# EAGLE design boxcar-v2c (EAGLE 5.10)
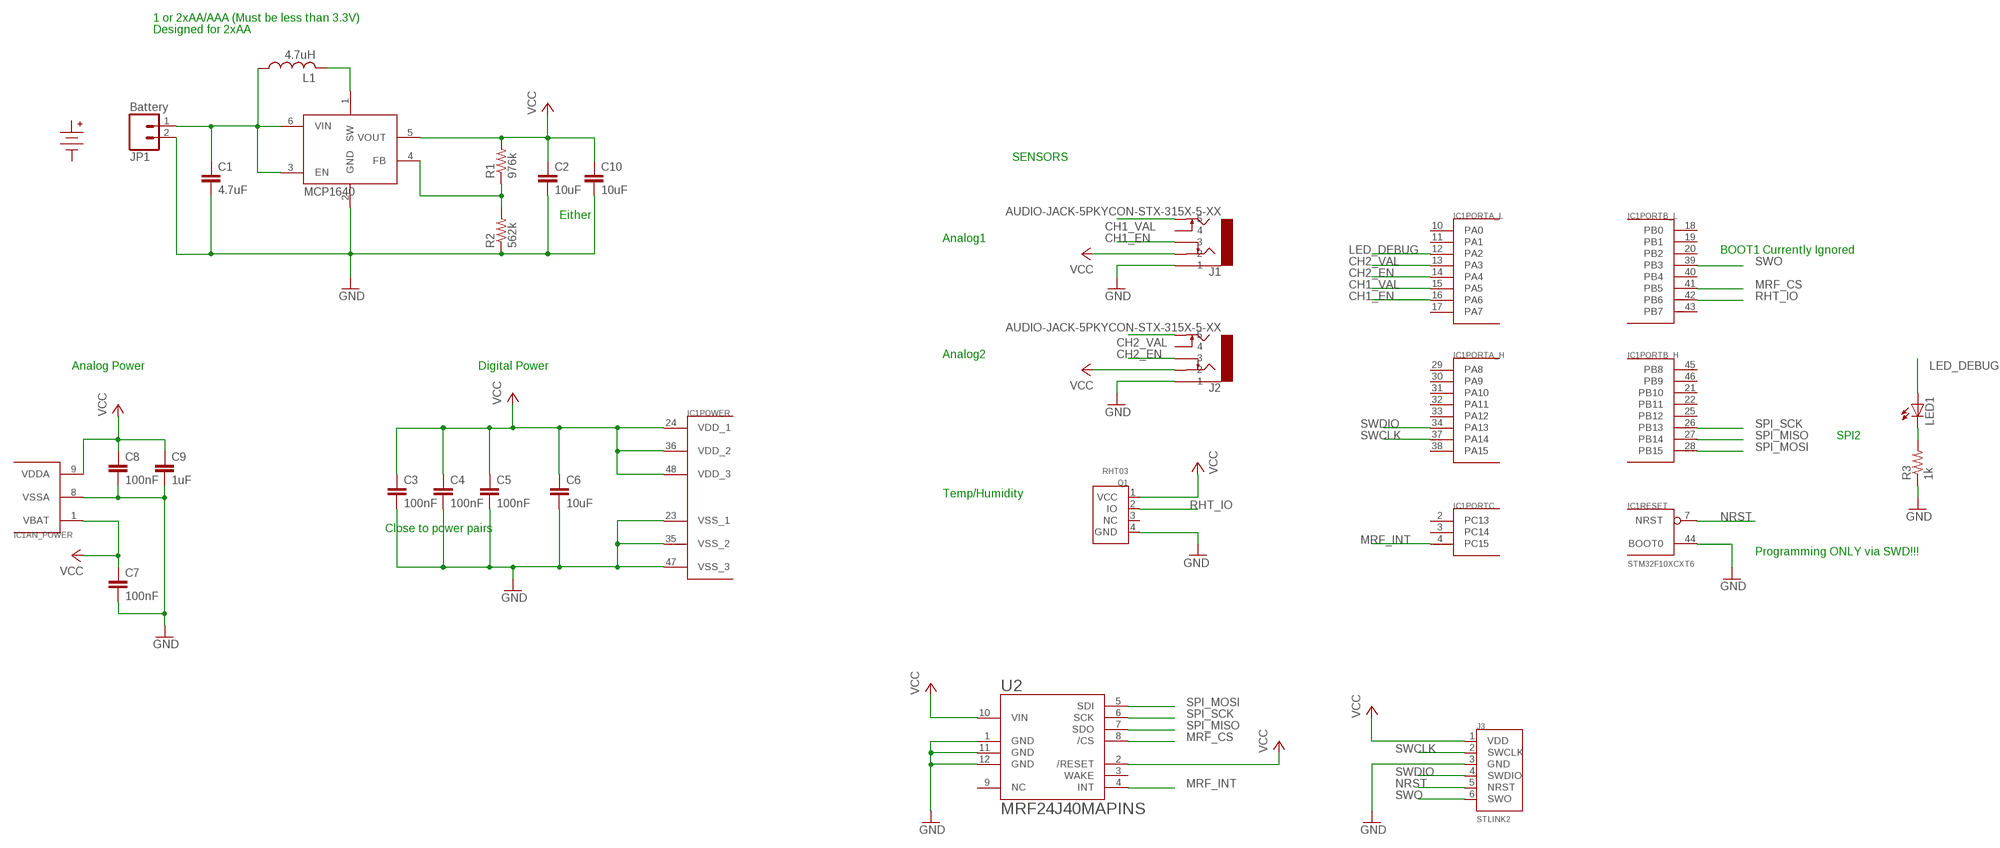
[diagram p0: schematic, sheet 1]

## Parts
C1  4.7uF  CAP0805  [0805]
C2  10uF  CAP0805  [0805]
C3  100nF  CAP0805  [0805]
C4  100nF  CAPPTH  [CAP-PTH-SMALL]
C5  100nF  CAP0805  [0805]
C6  10uF  CAP0805  [0805]
C7  100nF  CAP0805  [0805]
C8  100nF  CAP0805  [0805]
C9  1uF  CAPPTH  [CAP-PTH-SMALL]
C10  10uF  CAPPTH1  [CAP-PTH-5MM]
IC1  STM32F10XCXT6  [TQFP48]
J1  AUDIO-JACK-5PKYCON-STX-315X-5-XX  [KYCON-STX-315X-5-XX]
J2  AUDIO-JACK-5PKYCON-STX-315X-5-XX  [KYCON-STX-315X-5-XX]
J3  STLINK2  [STLINK2]
JP1  Battery  M02PTH  [1X02]
L1  4.7uH  LLQH44P_P0  [LQH44]
LED1  LED3MM  [LED3MM]
Q1  RHT03  [RHT03]
R1  976k  RESISTOR0805-RES  [0805]
R2  562k  RESISTOR0805-RES  [0805]
R3  1k  RESISTOR0805-RES  [0805]
U1  MCP1640  [SOT23-6]
U2  MRF24J40MAPINS  [MRF24J40MA]
U$1  BATTERY_LEADS  [KEYSTONE-2463]

## Nets
BAT+: C1.1 JP1.1 L1.P$1 U1.3(EN) U1.6(VIN)
CH1_EN: IC1.16(PORTA_L:PA6) J1.P$5
CH1_VAL: IC1.15(PORTA_L:PA5) J1.P$4
CH2_EN: IC1.14(PORTA_L:PA4) J2.P$5
CH2_VAL: IC1.13(PORTA_L:PA3) J2.P$4
GND: C1.2 C2.2 C3.2 C4.2 C5.2 C6.2 C7.2 C8.2 C9.2 C10.2 IC1.8(AN_POWER:VSSA) IC1.23(POWER:VSS_1) IC1.35(POWER:VSS_2) IC1.44(RESET:BOOT0) IC1.47(POWER:VSS_3) J1.P$1 J2.P$1 J3.3(GND) JP1.2 Q1.4(GND) R2.1 R3.1 U1.2(GND) U2.1(GND) U2.11(GND) U2.12(GND)
LED_DEBUG: IC1.12(PORTA_L:PA2) LED1.A
MRF_CS: IC1.41(PORTB_L:PB5) U2.8(/CS)
MRF_INT: IC1.4(PORTC:PC15) U2.4(INT)
N$1: L1.P$2 U1.1(SW)
N$3: LED1.K(C) R3.2
N$4: R1.1 R2.2 U1.4(FB)
NRST: IC1.7(RESET:NRST) J3.5(NRST)
RHT_IO: IC1.42(PORTB_L:PB6) Q1.2(IO)
SPI_MISO: IC1.27(PORTB_H:PB14) U2.7(SDO)
SPI_MOSI: IC1.28(PORTB_H:PB15) U2.5(SDI)
SPI_SCK: IC1.26(PORTB_H:PB13) U2.6(SCK)
SWCLK: IC1.37(PORTA_H:PA14) J3.2(SWCLK)
SWDIO: IC1.34(PORTA_H:PA13) J3.4(SWDIO)
SWO: IC1.39(PORTB_L:PB3) J3.6(SWO)
VCC: C2.1 C3.1 C4.1 C5.1 C6.1 C7.1 C8.1 C9.1 C10.1 IC1.1(AN_POWER:VBAT) IC1.9(AN_POWER:VDDA) IC1.24(POWER:VDD_1) IC1.36(POWER:VDD_2) IC1.48(POWER:VDD_3) J1.P$2 J2.P$2 J3.1(VDD) Q1.1(VCC) R1.2 U1.5(VOUT) U2.2(/RESET) U2.10(VIN)
Unconnected: IC1.2(PORTC:PC13) IC1.3(PORTC:PC14) IC1.5(PORTD/OSC:PD0/OSC<=) IC1.6(PORTD/OSC:PD1/OSC=>) IC1.10(PORTA_L:PA0) IC1.11(PORTA_L:PA1) IC1.17(PORTA_L:PA7) IC1.18(PORTB_L:PB0) IC1.19(PORTB_L:PB1) IC1.20(PORTB_L:PB2) IC1.21(PORTB_H:PB10) IC1.22(PORTB_H:PB11) IC1.25(PORTB_H:PB12) IC1.29(PORTA_H:PA8) IC1.30(PORTA_H:PA9) IC1.31(PORTA_H:PA10) IC1.32(PORTA_H:PA11) IC1.33(PORTA_H:PA12) IC1.38(PORTA_H:PA15) IC1.40(PORTB_L:PB4) IC1.43(PORTB_L:PB7) IC1.45(PORTB_H:PB8) IC1.46(PORTB_H:PB9) J1.P$3 J2.P$3 Q1.3(NC) U2.3(WAKE) U2.9(NC)

## Notes on the sheet
- 1 or 2xAA/AAA (Must be less than 3.3V)
- Designed for 2xAA
- SENSORS
- Either
- Analog1
- BOOT1 Currently Ignored
- Analog2
- Analog Power | Digital Power
- SPI2
- Temp/Humidity
- Close to power pairs
- Programming ONLY via SWD!!!

## Library data of the parts
C1-C10 = SparkFun:CAP: Capacitor Standard 0603 ceramic capacitor, and 0.1" leaded capacitor.
IC1 = stm32:STM32F10XCXT6: ST STM32F101/103 48pin LQFP
J1 J2 = karlnet-parts:AUDIO-JACK-5P: Stereo Audio Jack, with switches for each signal contact
J3 = karlnet-parts:STLINK2: STLink/v2 connector 6 pin inline header for SWD, as used on STM32 Discovery boards. (Except the 32VL discovery board, which only has the top 4 pins)
JP1 = SparkFun:M02: Header 2 Standard 2-pin 0.1" header. Use with straight break away headers (SKU : PRT-00116), right angle break away headers (PRT-00553), swiss pins (PRT-00743), machine pins (PRT-00117), and female headers (PRT-00115). Molex polarized connector foot print use with SKU : PRT-08233 with associated crimp pins and housings.
L1 = karlnet-parts:L
LED1 = SparkFun:LED: LEDs Standard schematic elements and footprints for 5mm, 3mm, 1206, and 0603 sized LEDs. 5mm - Spark Fun Electronics SKU : COM-00529 (and others)
Q1 = karlnet-parts:RHT03: RHT03 Temperature/Humidity sensor Also known as DHT22 and AM2302 Utilises a proprietary single pin interface. Occasionally reported to have pin 3 and 4 swapped (NC and ground) See also Sparkfun product page <http://www.sparkfun.com/products/10167>
R1-R3 = SparkFun:RESISTOR: Resistor Basic schematic elements and footprints for 0603, 1206, and PTH resistors.
U1 = karlnet-parts:MCP1640: MCP1623, 1624, 1640/B/C/D pwm/pfm or pwm only DC/DC converters, in SOT-23
U2 = karlnet-parts:MRF24J40MA: MRF24J40MA module, 802.15.4 from microchip.
U$1 = karlnet-parts:BATTERY_LEADS: Battery holders with leads, ie, mechanical placement only, no electrical connections

## Board
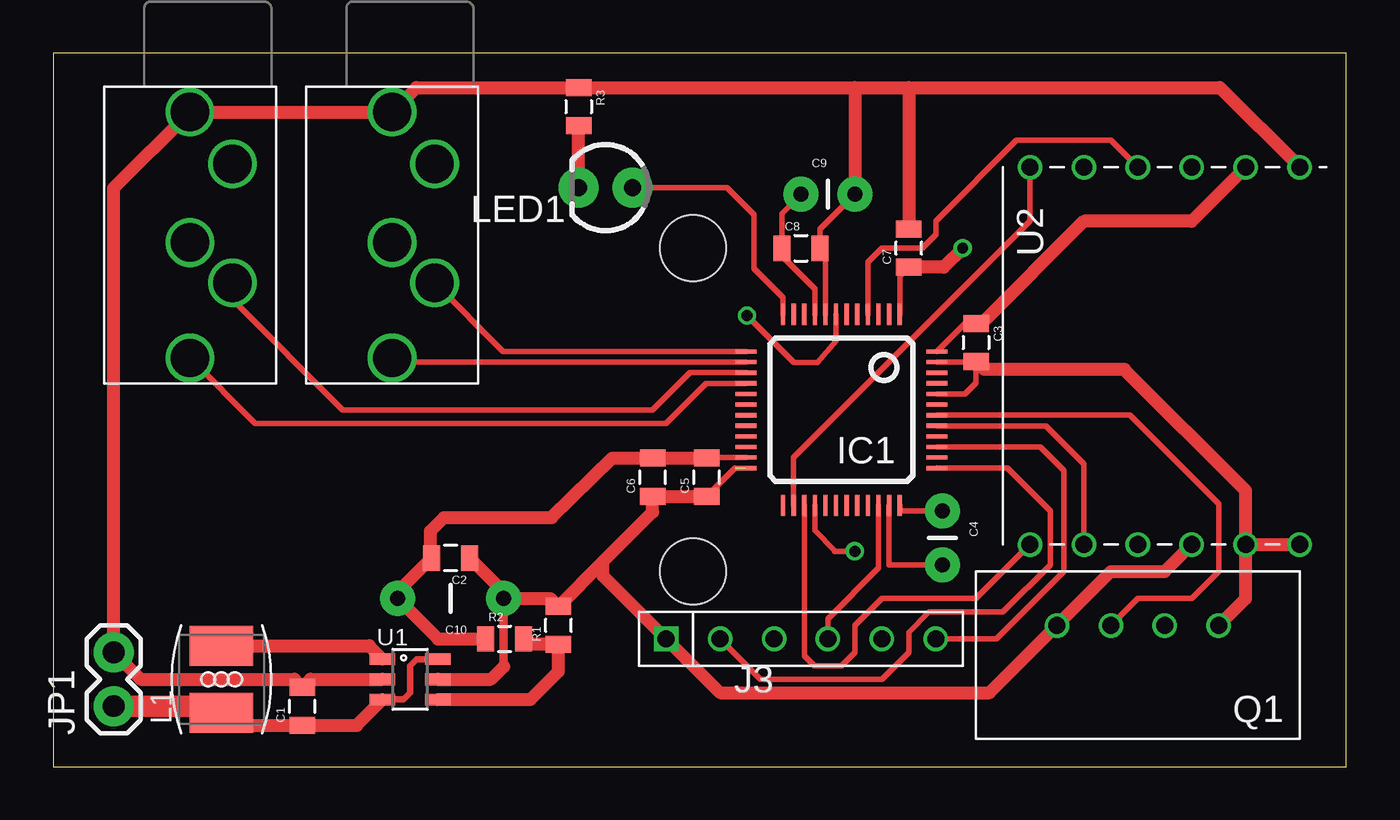
[diagram p1: board, top side]
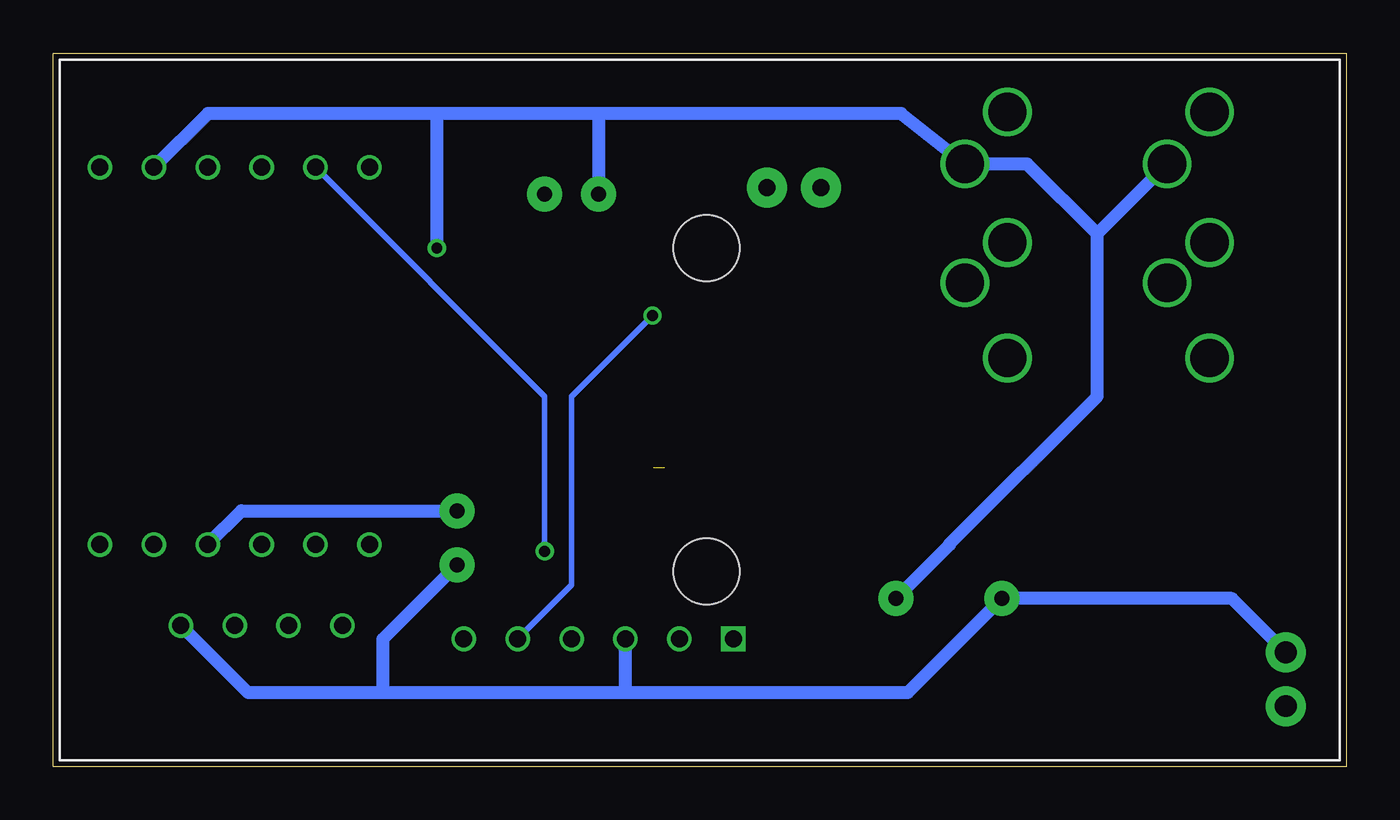
[diagram p2: board, bottom side, seen from below]

Size 60.95 x 33.65 mm. Coordinates in mm from the lower left corner, seen from the top.
Outline: 0,0 60.95,0 60.95,33.65 0,33.65 0,0
Copper layers (1*16): Top 0.0356mm / dielectric 1.5011mm / Bottom 0.0356mm
Design rules "dorkbot__LaenPCBOrder *": minimum track width 6mil, minimum drill 13mil, track to track 6mil, track to pad 6mil, pad to pad 6mil, via to via 6mil, smd to smd 6mil, copper to edge 15mil, drill to drill 6mil, minimum pad ring 7mil, minimum via ring 7mil, stop-mask expansion 4mil, vias tented up to drill 0mil, thermal gap 10mil

### Footprints (pad centres in the part's own frame; a part is rotated, then mirrored left to right if it is on the bottom)
0805 = smd 0.8 x 1.2: 1 -0.9,0; 2 0.9,0
CAP-PTH-SMALL = drill 0.7 pad 1.651 round: 1 0,0; 2 2.54,0
CAP-PTH-5MM = drill 0.7 pad 1.651 round: 1 -2.5,0; 2 2.5,0
TQFP48 = smd 0.2 x 1: 1 -2.75,-4.5; 2 -2.25,-4.5; 3 -1.75,-4.5; 4 -1.25,-4.5; 5 -0.75,-4.5; 6 -0.25,-4.5; 7 0.25,-4.5; 8 0.75,-4.5; 9 1.25,-4.5; 10 1.75,-4.5; 11 2.25,-4.5; 12 2.75,-4.5; 25 2.75,4.5; 26 2.25,4.5; 27 1.75,4.5; 28 1.25,4.5; 29 0.75,4.5; 30 0.25,4.5; 31 -0.25,4.5; 32 -0.75,4.5; 33 -1.25,4.5; 34 -1.75,4.5; 35 -2.25,4.5; 36 -2.75,4.5 | smd 1 x 0.2: 13 4.5,-2.75; 14 4.5,-2.25; 15 4.5,-1.75; 16 4.5,-1.25; 17 4.5,-0.75; 18 4.5,-0.25; 19 4.5,0.25; 20 4.5,0.75; 21 4.5,1.25; 22 4.5,1.75; 23 4.5,2.25; 24 4.5,2.75; 37 -4.5,2.75; 38 -4.5,2.25; 39 -4.5,1.75; 40 -4.5,1.25; 41 -4.5,0.75; 42 -4.5,0.25; 43 -4.5,-0.25; 44 -4.5,-0.75; 45 -4.5,-1.25; 46 -4.5,-1.75; 47 -4.5,-2.25; 48 -4.5,-2.75
KYCON-STX-315X-5-XX = drill 1.8 pad 2.3 round: P$1 -3.88,0.42; P$2 -1.43,2.42; P$3 2.27,0.42; P$4 4.17,2.42; P$5 7.72,0.42
STLINK2 = drill 0.8 square: 1 0,5.08 | drill 0.8 round: 2 0,2.54; 3 0,0; 4 0,-2.54; 5 0,-5.08; 6 0,-7.62
1X02 = drill 1.016 pad 1.88 round: 1 0,0; 2 2.54,0
LQH44 = smd 1.9 x 3: P$1 -1.577,0; P$2 1.577,0
LED3MM = drill 0.813 pad 1.88 round: A -1.27,0; K 1.27,0
RHT03 = drill 0.8 round: 1 5.08,0; 2 2.54,0; 3 0,0; 4 -2.54,0
SOT23-6 = smd 0.55 x 1.2: 1 -0.95,-1.3; 2 0,-1.3; 3 0.95,-1.3; 4 0.95,1.3; 5 0,1.3; 6 -0.95,1.3
MRF24J40MA = drill 0.8 round: 1 -8.89,12.7; 2 -8.89,10.16; 3 -8.89,7.62; 4 -8.89,5.08; 5 -8.89,2.54; 6 -8.89,0; 7 8.89,0; 8 8.89,2.54; 9 8.89,5.08; 10 8.89,7.62; 11 8.89,10.16; 12 8.89,12.7
KEYSTONE-2463 = hole 3.1: 29.845,8.89; 29.845,24.13

### Placement (x,y rotation side)
C1  11.75,2.86 90 top
C2  18.73,9.84 180 top
C3  43.5,20 270 top
C4  41.91,12.06 270 top
C5  30.8,13.65 90 top
C6  28.26,13.65 90 top
C7  40.32,24.45 90 top
C8  35.24,24.45 0 top
C9  35.24,26.99 0 top
C10  18.73,7.94 180 top
IC1  37.15,16.83 180 top
J1  6.03,26.99 270 top
J2  15.56,26.99 270 top
J3  33.97,6.03 90 top
JP1  2.86,2.86 90 top
L1  7.94,4.13 90 top
LED1  26.04,27.3 180 top
Q1  52.39,6.67 180 top
R1  23.81,6.67 90 top
R2  21.27,6.03 0 top
R3  24.77,31.11 270 top
U1  16.83,4.13 270 top
U2  46.04,19.37 270 top
U$1  0.32,0.32 0 top

### Tracks (layer width: path | path; a pad name or v marks a point on that pad's centre or on a via)
BAT+
  Top 0.305: U1.6 17.14,5.08 16.83,4.76 16.83,3.49 16.51,3.18 U1.3
  Top 0.61: L1.P$1 7.94,1.96 C1.1 14.31,1.96 U1.3
  Top 1.016: JP1.1 7.63,2.86 L1.P$1
CH1_EN
  Top 0.254: IC1.16 30.78,18.08 28.89,16.19 9.53,16.19 J1.P$5
CH1_VAL
  Top 0.254: J1.P$4 8.45,22.03 13.65,16.83 28.26,16.83 30.01,18.58 IC1.15
CH2_EN
  Top 0.254: IC1.14 16.17,19.08 J2.P$5
CH2_VAL
  Top 0.254: J2.P$4 21.22,19.58 IC1.13
GND
  Top 0.254: IC1.23 30.82,14.58 C5.2 | IC1.47 43.47,19.08 C3.2 43.5,18.1 42.98,17.58 IC1.44 | IC1.8 36.4,24.45 C8.2 36.14,25.35 C9.2 | IC1.35 39.4,9.53 C4.2
  Top 0.61: U1.2 12.12,4.13 C1.2 11.38,4.13 4.13,4.13 JP1.2 2.86,27.27 J1.P$1 J2.P$1 17.12,32.02 R3.1 37.78,32.02 | R2.1 18.14,6.03 C10.2 16.23,8.24 C2.2 17.78,9.89 17.78,11.11 18.41,11.75 23.5,11.75 26.35,14.55 C6.2 C5.2 | Q1.4 56.2,7.94 U2.11 | U2.11 U2.12 | U2.11 56.2,13.02 50.48,18.73 43.87,18.73 C3.2 | U2.1 54.98,32.02 40.32,32.02 | 37.78,32.02 40.32,32.02 | 40.32,32.02 C7.2 | 37.78,32.02 C9.2
  Bottom 0.61: JP1.2 5.4,7.94 C10.2 20.68,3.49 33.97,3.49 | Q1.4 51.75,3.49 45.4,3.49 | 33.97,3.49 45.4,3.49 | 33.97,3.49 J3.3 | C4.2 45.4,6.03 45.4,3.49
LED_DEBUG
  Top 0.254: IC1.12 34.4,22.12 33.02,23.5 33.02,26.04 31.75,27.3 LED1.A
MRF_CS
  Top 0.254: U2.8 48.58,14.29 46.79,16.08 IC1.41
MRF_INT
  Top 0.254: U2.4 49.85,29.53 45.4,29.53 41.59,25.72 41.59,25.08 40.96,24.45 39.05,24.45 38.4,23.79 IC1.4
N$1
  Top 0.61: L1.P$2 14.9,5.71 U1.1
N$3
  Top 0.61: LED1.K R3.2
N$4
  Top 0.61: U1.4 22.49,3.18 23.81,4.5 R1.1 22.44,5.77 R2.2
NRST  (via drill 0.51)
  Top 0.254: v32.7,21.27 34.92,19.05 36.01,19.05 36.9,20.07 IC1.7
  Bottom 0.254: J3.5 36.51,8.57 36.51,17.46 v32.7,21.27
RHT_IO
  Top 0.254: Q1.2 51.12,7.94 53.66,7.94 54.93,9.21 54.93,12.38 50.73,16.58 IC1.42
SPI_MISO
  Top 0.254: IC1.27 35.4,5.24 35.88,4.76 37.15,4.76 37.78,5.4 37.78,6.67 39.05,7.94 43.5,7.94 U2.7
SPI_MOSI  (via drill 0.51)
  Top 0.254: v37.78,10.16 36.83,10.16 36.83,10.2 35.9,11.13 IC1.28
  Bottom 0.254: U2.5 37.78,17.46 v37.78,10.16
SPI_SCK
  Top 0.254: IC1.26 34.9,14.58 46.04,25.72 U2.6
SWCLK
  Top 0.254: J3.2 33.34,4.13 39.05,4.13 40.32,5.4 40.32,6.35 41.27,7.3 44.77,7.3 46.99,9.53 46.99,12.06 44.98,14.08 IC1.37
SWDIO
  Top 0.254: J3.4 36.51,6.99 38.9,9.37 IC1.34
SWO
  Top 0.254: J3.6 44.45,6.03 47.62,9.21 47.62,13.97 46.52,15.08 IC1.39
VCC  (via drill 0.51)  (1 unrouted)
  Top 0.254: C5.1 32.12,14.08 | IC1.1 39.9,23.12 C7.1 | IC1.9 35.9,22.54 35.88,22.54 34.34,24.08 C8.1 34.34,26.09 C9.1 | IC1.36 39.9,12.06 C4.1 | IC1.48 42.97,20.9 C3.1
  Top 0.406: 21.23,4.72 C10.1
  Top 0.61: 21.23,4.72 20.64,4.13 U1.5 | C5.1 C6.1 28.26,12.01 25.9,9.66 | 25.9,9.66 R1.2 23.44,7.94 C10.1 21.23,8.24 C2.1 | 25.9,9.66 25.9,9.02 J3.1 31.43,3.49 44.13,3.49 Q1.1 49.85,9.21 52.39,9.21 U2.10 | U2.2 53.66,25.72 48.58,25.72 43.76,20.9 C3.1 | C7.1 41.96,23.55 v42.86,24.45
  Bottom 0.61: C10.1 18.69,10.48 18.73,10.48 11.75,17.46 11.75,25.12 | U2.2 53.66,30.8 42.86,30.8 | 35.24,30.8 20.99,30.8 J2.P$2 15.04,28.42 11.75,25.12 | 35.24,30.8 42.86,30.8 | 35.24,30.8 C9.1 | 42.86,30.8 v42.86,24.45 | C4.1 52.07,12.06 U2.10 | 11.75,25.12 J1.P$2